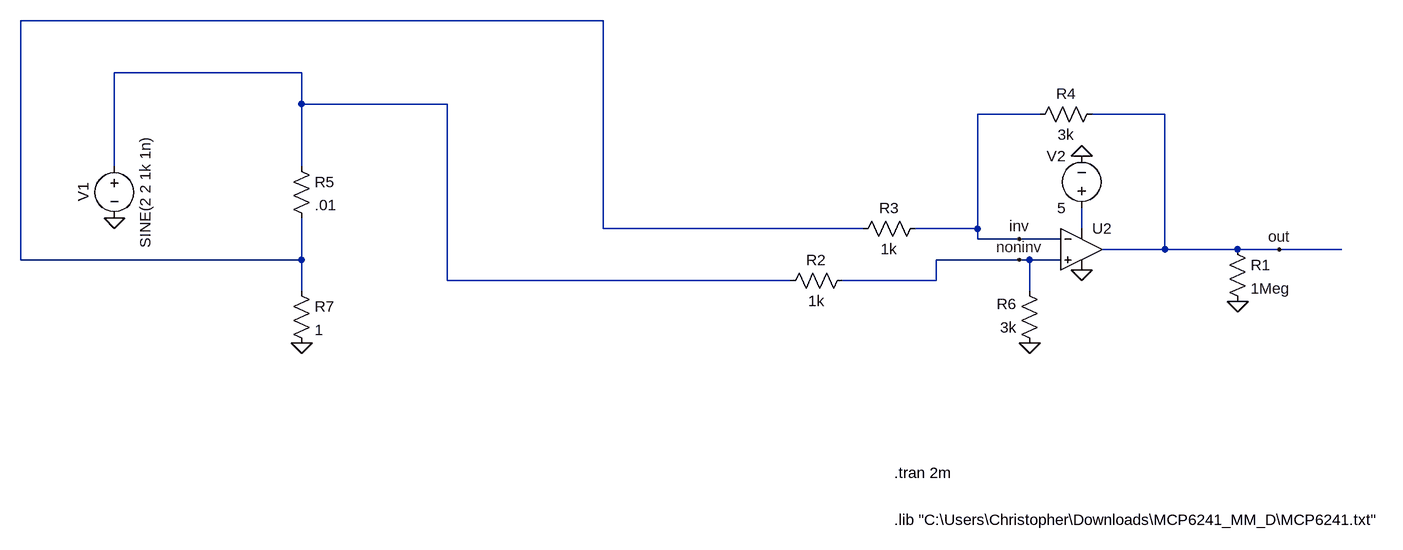
[diagram p0: schematic testing_subtract.asc]
testing_subtract.asc, the LTspice schematic file:
Version 4.1
SHEET 1 1040 680
WIRE -240 -192 -1136 -192
WIRE -704 -112 -992 -112
WIRE -704 -64 -704 -112
WIRE -480 -64 -704 -64
WIRE 432 -48 336 -48
WIRE 624 -48 512 -48
WIRE -992 32 -992 -112
WIRE -704 32 -704 -64
WIRE -240 128 -240 -192
WIRE 160 128 -240 128
WIRE 336 128 336 -48
WIRE 336 128 240 128
WIRE 496 128 496 96
WIRE 336 144 336 128
WIRE 400 144 336 144
WIRE 464 144 400 144
WIRE 624 160 624 -48
WIRE 624 160 528 160
WIRE 736 160 624 160
WIRE 800 160 736 160
WIRE 896 160 800 160
WIRE -1136 176 -1136 -192
WIRE -704 176 -704 112
WIRE -704 176 -1136 176
WIRE 400 176 272 176
WIRE 416 176 400 176
WIRE 464 176 416 176
WIRE -480 208 -480 -64
WIRE 48 208 -480 208
WIRE 272 208 272 176
WIRE 272 208 128 208
WIRE -704 224 -704 176
WIRE 416 224 416 176
FLAG 496 192 0
FLAG 496 16 0
FLAG 800 160 out
FLAG 416 304 0
FLAG 400 144 inv
FLAG 400 176 noninv
FLAG 736 240 0
FLAG -992 112 0
FLAG -704 304 0
SYMBOL voltage 496 112 R180
WINDOW 0 24 96 Left 2
WINDOW 3 24 16 Left 2
SYMATTR InstName V2
SYMATTR Value 5
SYMBOL res 256 112 R90
WINDOW 0 0 56 VBottom 2
WINDOW 3 32 56 VTop 2
SYMATTR InstName R3
SYMATTR Value 1k
SYMBOL res 528 -64 R90
WINDOW 0 0 56 VBottom 2
WINDOW 3 32 56 VTop 2
SYMATTR InstName R4
SYMATTR Value 3k
SYMBOL res 432 320 R180
WINDOW 0 36 76 Left 2
WINDOW 3 36 40 Left 2
SYMATTR InstName R6
SYMATTR Value 3k
SYMBOL res 720 144 R0
SYMATTR InstName R1
SYMATTR Value 1Meg
SYMBOL res 144 192 R90
WINDOW 0 0 56 VBottom 2
WINDOW 3 32 56 VTop 2
SYMATTR InstName R2
SYMATTR Value 1k
SYMBOL voltage -992 16 R0
WINDOW 0 -32 56 VBottom 2
WINDOW 3 32 56 VTop 2
WINDOW 123 0 0 Left 0
WINDOW 39 0 0 Left 0
SYMATTR InstName V1
SYMATTR Value SINE(2 2 1k 1n)
SYMBOL OpAmps\\UniversalOpAmp2 496 160 R0
SYMATTR InstName U2
SYMBOL res -720 16 R0
SYMATTR InstName R5
SYMATTR Value .01
SYMBOL res -720 208 R0
SYMATTR InstName R7
SYMATTR Value 1
TEXT 208 576 Left 2 !.lib "C:\\Users\\Christopher\\Downloads\\MCP6241_MM_D\\MCP6241.txt"
TEXT 208 504 Left 2 !.tran 2m

The netlist it stands for:
* testing_subtract.asc
V2 N003 0 5
R3 inv N001 1k
R4 out inv 3k
R6 0 noninv 3k
R1 out 0 1Meg
R2 noninv N002 1k
V1 N002 0 SINE(2 2 1k 1n)
X§U2 noninv inv N003 0 out level2 Avol=1Meg GBW=10Meg Slew=10Meg Ilimit=25m Rail=0 Vos=0 En=0 Enk=0 In=0 Ink=0 Rin=500Meg  ; pins In+ In- V+ V- OUT
R5 N002 N001 .01
R7 N001 0 1
.lib "C:\Users\Christopher\Downloads\MCP6241_MM_D\MCP6241.txt"
.tran 2m
.lib UniversalOpAmp2.lib
.backanno
.end